# Altium schematic sheet S7CAS-PLEIADES-CARTE-MERE_P02_USER_IO.SchDoc
size Tabloid; DocumentNumber: 14; SheetNumber: 14; SheetTotal: 14; Sheet_Name: User IO; Size: 11x17
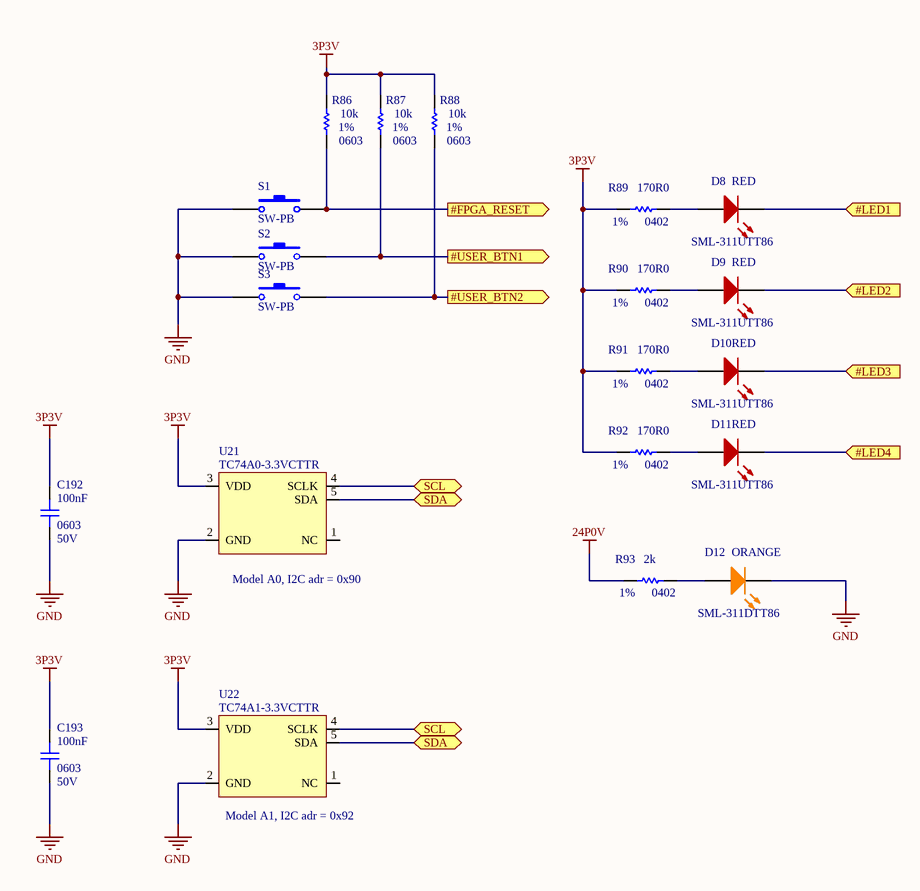
[diagram p0: S7CAS-PLEIADES-CARTE-MERE_P02_USER_IO.SchDoc]

## Parts
C192  value 100nF  Voltage: 50V  Package: 0603  [CAP_0603]  (hidden comment: CAP - 0603)
C193  value 100nF  Voltage: 50V  Package: 0603  [CAP_0603]  (hidden comment: CAP - 0603)
D8  SML-311UTT86  value RED  [LED_0603]
D9  SML-311UTT86  value RED  [LED_0603]
D10  SML-311UTT86  value RED  [LED_0603]
D11  SML-311UTT86  value RED  [LED_0603]
D12  SML-311DTT86  value ORANGE  [LED_0603]
R86  value 10k  Package: 0603  Precision: 1%  [RES_0603]  (hidden comment: RES - 0603)
R87  value 10k  Package: 0603  Precision: 1%  [RES_0603]  (hidden comment: RES - 0603)
R88  value 10k  Package: 0603  Precision: 1%  [RES_0603]  (hidden comment: RES - 0603)
R89  value 170R0  Package: 0402  Precision: 1%  [RES_0402]  (hidden comment: RES - 0402)
R90  value 170R0  Package: 0402  Precision: 1%  [RES_0402]  (hidden comment: RES - 0402)
R91  value 170R0  Package: 0402  Precision: 1%  [RES_0402]  (hidden comment: RES - 0402)
R92  value 170R0  Package: 0402  Precision: 1%  [RES_0402]  (hidden comment: RES - 0402)
R93  value 2k  Package: 0402  Precision: 1%  [RES_0402]  (hidden comment: RES - 0402)
S1  SW-PB  [SPST-2]
S2  SW-PB  [SPST-2]
S3  SW-PB  [SPST-2]
U21  TC74A0-3.3VCTTR  [SEN_TEMP_TC74A0-3.3VCTTR]
U22  TC74A1-3.3VCTTR  [SEN_TEMP_TC74A0-3.3VCTTR]

## Ports
#FPGA_RESET (out), #LED1 (in), #LED2 (in), #LED3 (in), #LED4 (in), #USER_BTN1 (out), #USER_BTN2 (out), SCL (bidir), SDA (bidir)

## Nets
3P3V: C192.2 C193.2 R86.2 R87.2 R88.2 R89.2 R90.2 R91.2 R92.2 U21.3(VDD) U22.3(VDD)
24P0V: R93.2
GND: C192.1 C193.1 D12.K S1.1 S2.1 S3.1 U21.2(GND) U22.2(GND)
#FPGA_RESET: R86.1 S1.2 ; port #FPGA_RESET
#LED1: D8.K ; port #LED1
#LED2: D9.K ; port #LED2
#LED3: D10.K ; port #LED3
#LED4: D11.K ; port #LED4
#USER_BTN1: R87.1 S2.2 ; port #USER_BTN1
#USER_BTN2: R88.1 S3.2 ; port #USER_BTN2
SCL: U21.4(SCLK) U22.4(SCLK) ; port SCL
SDA: U21.5(SDA) U22.5(SDA) ; port SDA
NetD8_A: D8.A R89.1
NetD9_A: D9.A R90.1
NetD10_A: D10.A R91.1
NetD11_A: D11.A R92.1
NetD12_A: D12.A R93.1

Not connected (* = marked no-connect by the designer): U21 1(NC); U22 1(NC)

## Notes on the sheet
- (near U21) Model A0, I2C adr = 0x90
- (near U22) Model A1, I2C adr = 0x92
- Sheet Name
- Project Title
- Global Project
- Size
- Group
- Revision
- Date
- Sheet
- of
- Filename
- Designers

## Library data of the parts
C192 C193 = CAP - 0603: Precision: 10%; Current: *; CreatedBy: Jonathan Bouchard; Power: *
D8-D11 = LED_SML-311UTT86: LED - 620nM RED 2mA - 0603; Voltage: 1.8V; Mfg: ROHM Semiconductor; Power: 44mW; Current: 2mA; HelpURL: http://media.digikey.com/pdf/Data%20Sheets/Rohm%20PDFs/SML-311%20Series.pdf; CreatedBy: Jonathan Bouchard; Temperature: -30°C to 85°C; Package: 0603; Precision: *; Mfg Part Number: SML-311UTT86; Supplier 1: Digikey; Supplier Part Number 1: 511-1304-1-ND
D12 = LED_SML-311DTT86: LED - 611nM ORANGE 2mA - 0603; Voltage: 1.8V; Mfg: ROHM Semiconductor; Power: 44mW; Current: 2mA; HelpURL: http://media.digikey.com/pdf/Data%20Sheets/Rohm%20PDFs/SML-311%20Series.pdf; CreatedBy: Jonathan Bouchard; Temperature: -40°C to 85°C; Package: 0603; Precision: *; Mfg Part Number: SML-311DTT86; Supplier 1: Digikey; Supplier Part Number 1: 511-1303-1-ND
R89-R93 = RES - 0402: Voltage: 50V; Power: 1/16W; Current: *; CreatedBy: Jonathan Bouchard
S1-S3 = SW-PB: Switch; Published: 24-Mar-1999; LatestRevisionDate: 17-Jul-2002; LatestRevisionNote: Re-released for DXP Platform.; PackageReference: SPST-2; Publisher: Altium Limited; PackageDescription: Switch; 2 Leads
U21 U22 = SENS_TEMP_TC74A0-3.3VCTTR: SENS - TEMPERATURE SENSOR I2C/SMBUS - SOT23-5; Voltage: 2.7 V ~ 5.5 V; Mfg: Microchip; Precision: ±2°C (±3°C); Current: *; Power: *; Mfg Part Number: TC74A0-3.3VCTTR; HelpURL: http://ww1.microchip.com/downloads/en/DeviceDoc/21462D.pdf; CreatedBy: Jonathan Bouchard; Temperature: -40°C ~ 125°C; Value: *; Package: SOT23-5; Supplier 1: Digikey; Supplier Part Number 1: TC74A0-3.3VCTDKR-ND
R86-R88 = RES - 0603: Current: *; CreatedBy: Jonathan Bouchard